# Altium schematic sheet MAX78630 SOC.SchDoc: MAX78630 SOC Core
size 393 x 292 mm; SheetNumber: 8; SheetTotal: 8
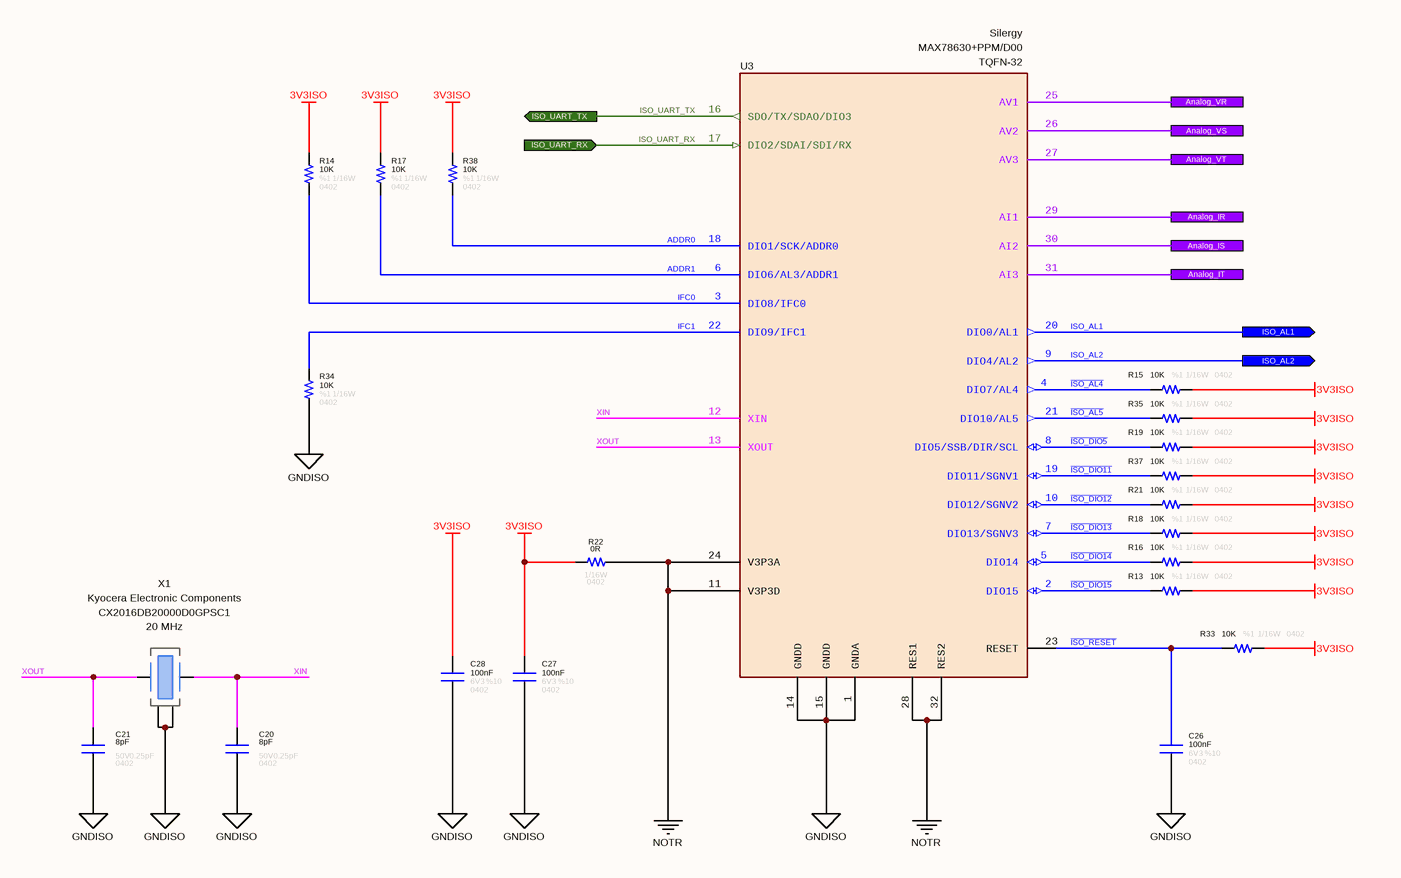
[diagram p0: MAX78630 SOC.SchDoc]

## Parts
C20  value 8pF  Tolerance: 0.25pF  Case: 0402  Voltage: 50V  [CAPACITOR_0402]  (hidden comment: Capacitor - 8pF [0402] (Ceramic))
C21  value 8pF  Tolerance: 0.25pF  Case: 0402  Voltage: 50V  [CAPACITOR_0402]  (hidden comment: Capacitor - 8pF [0402] (Ceramic))
C26  value 100nF  Tolerance: %10  Voltage: 6V3  Case: 0402  [CAPACITOR_0402]  (hidden comment: Capacitor - 100nF [0402] (Ceramic))
C27  value 100nF  Tolerance: %10  Voltage: 6V3  Case: 0402  [CAPACITOR_0402]  (hidden comment: Capacitor - 100nF [0402] (Ceramic))
C28  value 100nF  Tolerance: %10  Voltage: 6V3  Case: 0402  [CAPACITOR_0402]  (hidden comment: Capacitor - 100nF [0402] (Ceramic))
R13  value 10K  Tolerance: %1  Case: 0402  Power: 1/16W  [RESISTOR_0402]  (hidden comment: 10K - 0402 - %1 - 1/16W)
R14  value 10K  Tolerance: %1  Case: 0402  Power: 1/16W  [RESISTOR_0402]  (hidden comment: 10K - 0402 - %1 - 1/16W)
R15  value 10K  Tolerance: %1  Case: 0402  Power: 1/16W  [RESISTOR_0402]  (hidden comment: 10K - 0402 - %1 - 1/16W)
R16  value 10K  Tolerance: %1  Case: 0402  Power: 1/16W  [RESISTOR_0402]  (hidden comment: 10K - 0402 - %1 - 1/16W)
R17  value 10K  Tolerance: %1  Case: 0402  Power: 1/16W  [RESISTOR_0402]  (hidden comment: 10K - 0402 - %1 - 1/16W)
R18  value 10K  Tolerance: %1  Case: 0402  Power: 1/16W  [RESISTOR_0402]  (hidden comment: 10K - 0402 - %1 - 1/16W)
R19  value 10K  Tolerance: %1  Case: 0402  Power: 1/16W  [RESISTOR_0402]  (hidden comment: 10K - 0402 - %1 - 1/16W)
R21  value 10K  Tolerance: %1  Case: 0402  Power: 1/16W  [RESISTOR_0402]  (hidden comment: 10K - 0402 - %1 - 1/16W)
R22  value 0R  Case: 0402  Power: 1/16W  [RESISTOR_0402]  (hidden comment: 0R - 0402 - %1 - 1/16W)
R33  value 10K  Tolerance: %1  Case: 0402  Power: 1/16W  [RESISTOR_0402]  (hidden comment: 10K - 0402 - %1 - 1/16W)
R34  value 10K  Tolerance: %1  Case: 0402  Power: 1/16W  [RESISTOR_0402]  (hidden comment: 10K - 0402 - %1 - 1/16W)
R35  value 10K  Tolerance: %1  Case: 0402  Power: 1/16W  [RESISTOR_0402]  (hidden comment: 10K - 0402 - %1 - 1/16W)
R37  value 10K  Tolerance: %1  Case: 0402  Power: 1/16W  [RESISTOR_0402]  (hidden comment: 10K - 0402 - %1 - 1/16W)
R38  value 10K  Tolerance: %1  Case: 0402  Power: 1/16W  [RESISTOR_0402]  (hidden comment: 10K - 0402 - %1 - 1/16W)
U3  Manufacturer Name: Silergy  Case: TQFN-32  [TQFN-32 - Maxim]  (hidden comment: MAX78630+PPM/D00)
X1  Manufacturer Name: Kyocera Electronic Components  Frequency: 20 MHz  [CRYSTAL - 20MHz]  (hidden comment: CX2016DB20000D0GPSC1)

## Ports
Analog_IR, Analog_IS, Analog_IT, Analog_VR, Analog_VS, Analog_VT, ISO_AL1 (out), ISO_AL2 (out), ISO_UART_RX (in), ISO_UART_TX (out)

## Nets
3V3ISO: C27.2 C28.2 R13.1 R14.2 R15.1 R16.1 R17.2 R18.1 R19.1 R21.1 R22.2 R33.1 R35.1 R37.1 R38.2
GNDISO: C20.1 C21.1 C26.1 C27.1 C28.1 R34.1 U3.1(GNDA) U3.14(GNDD) U3.15(GNDD) X1.2(GND) X1.4(GND)
NOTR: R22.1 U3.11(V3P3D) U3.24(V3P3A) U3.28(RES1) U3.32(RES2)
ADDR0: R38.1 U3.18(DIO1/SCK/ADDR0)
ADDR1: R17.1 U3.6(DIO6/AL3/ADDR1)
Analog_IR: U3.29(AI1) ; port Analog_IR
Analog_IS: U3.30(AI2) ; port Analog_IS
Analog_IT: U3.31(AI3) ; port Analog_IT
Analog_VR: U3.25(AV1) ; port Analog_VR
Analog_VS: U3.26(AV2) ; port Analog_VS
Analog_VT: U3.27(AV3) ; port Analog_VT
~{ISO_AL4}: R15.2 U3.4(DIO7/AL4)
~{ISO_AL5}: R35.2 U3.21(DIO10/AL5)
~{ISO_DIO11}: R37.2 U3.19(DIO11/SGNV1)
~{ISO_DIO12}: R21.2 U3.10(DIO12/SGNV2)
~{ISO_DIO13}: R18.2 U3.7(DIO13/SGNV3)
~{ISO_DIO14}: R16.2 U3.5(DIO14)
~{ISO_DIO15}: R13.2 U3.2(DIO15)
~{ISO_DIO5}: R19.2 U3.8(DIO5/SSB/DIR/SCL)
~{ISO_RESET}: C26.2 R33.2 U3.23(RESET)
IFC0: R14.1 U3.3(DIO8/IFC0)
IFC1: R34.2 U3.22(DIO9/IFC1)
ISO_AL1: U3.20(DIO0/AL1) ; port ISO_AL1
ISO_AL2: U3.9(DIO4/AL2) ; port ISO_AL2
ISO_UART_RX: U3.17(DIO2/SDAI/SDI/RX) ; port ISO_UART_RX
ISO_UART_TX: U3.16(SDO/TX/SDAO/DIO3) ; port ISO_UART_TX
XIN: C20.2 U3.12(XIN) X1.1(IN/OUT)
XOUT: C21.2 U3.13(XOUT) X1.3(OUT/IN)

## Notes on the sheet
- © 2021 All rights reserved.
  This document may not, in whole or in part, be copied, photocopied, reproduced, translated or converted to any electronic or machine readable from without prior written permission of Mehmet Günce Akkoyun.
  Engineer contact : akkoyun@me.com
- Property of
- Engineer :
- Date :
- Size :
- A4
- Time :
- Project :
- Page :
- /
- Customer :
- Product ID :
- Module ID :
- Version :
- File :
- Revision :

## Library data of the parts
C20 C21 = Capacitor - 8pF [0402-50V]: Manufacturer Name: KYOCERA AVX; Manufacturer Part Number: 04025A8R0CAT2A
C26-C28 = Capacitor - 100nF [0402-6V3]: Capacitor - 100nF [0402-6V3] (Ceramic); Manufacturer Name: AVX; Manufacturer Part Number: 04026D104KAT4A; ComponentLink1Description: Mouser; ComponentLink1URL: https://www.mouser.com.tr/ProductDetail/AVX/04026D104KAT4A?qs=sGAEpiMZZMs0AnBnWHyRQPg4iYkCw7IMED%2F4kpqgf7w%3D; ComponentLink2Description: DataSheet; ComponentLink2URL: https://www.mouser.com.tr/datasheet/2/40/cx5r-776519.pdf
R13-R19 R21 R33-R35 R37 R38 = Resistor - 10K [0402]: Thick Film Resistors - SMD 1/16 W 10 KOhm 1%; Manufacturer Name: Vishay; Manufacturer Part Number: CRCW040210K0FKED; ComponentLink1Description: DataSheet; ComponentLink1URL: https://www.mouser.com.tr/datasheet/2/427/dcrcwe3-1762152.pdf; ComponentLink2Description: Mouser; ComponentLink2URL: https://www.mouser.com.tr/ProductDetail/Vishay-Dale/CRCW040210K0FKED?qs=sGAEpiMZZMu61qfTUdNhG2DpbjADlD3GcalbOv9utCY%3D
R22 = Resistor - 0R [0402]: Thick Film Resistors - SMD 1/16 W 0 Ohm; Manufacturer Name: Vishay; Manufacturer Part Number: CRCW04020000Z0ED; ComponentLink1Description: DataSheet; ComponentLink1URL: https://www.mouser.com.tr/datasheet/2/427/dcrcwe3-1762152.pdf; ComponentLink2Description: Mouser; ComponentLink2URL: https://www.mouser.com.tr/ProductDetail/Vishay-Dale/CRCW04020000Z0ED?qs=sGAEpiMZZMu61qfTUdNhG2DpbjADlD3GG34cJb50zyg%3D
U3 = IC - MAX78630: Energy Measurement Processor 32-Pin TQFN EP Tube; RoHS: Yes; Manufacturer Part Number: MAX78630+PPM/D00
X1 = Crystal - 20MHz: Crystals AEC-Q200 20000kHz 8pF 2x1.6mm; Case: SMD; Manufacturer Part Number: CX2016DB20000D0GPSC1